# Altium schematic sheet USB2514 USB PORTS.SchDoc
size A4; DocumentNumber: 3; SheetNumber: 3; SheetTotal: 6
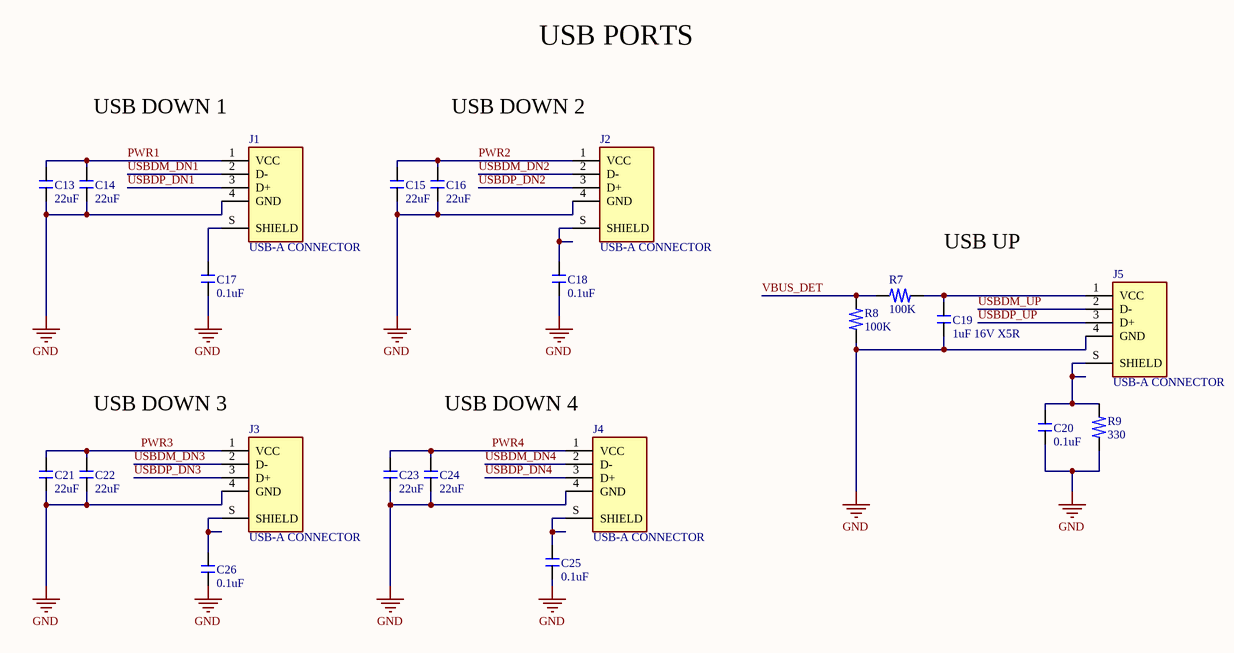
[diagram p0: USB2514 USB PORTS.SchDoc]

## Parts
C13  22uF  [CAPC3216X10N-1206]
C14  22uF  [CAPC3216X10N-1206]
C15  22uF  [CAPC3216X10N-1206]
C16  22uF  [CAPC3216X10N-1206]
C17  0.1uF  [CAPC1608X06N-0603]
C18  0.1uF  [CAPC1608X06N-0603]
C19  1uF 16V X5R  [CAPC1608X06N-0603]
C20  0.1uF  [CAPC1608X06N-0603]
C21  22uF  [CAPC3216X10N-1206]
C22  22uF  [CAPC3216X10N-1206]
C23  22uF  [CAPC3216X10N-1206]
C24  22uF  [CAPC3216X10N-1206]
C25  0.1uF  [CAPC1608X06N-0603]
C26  0.1uF  [CAPC1608X06N-0603]
J1  USB-A CONNECTOR  [USB-U-A-24DS-Y-1]
J2  USB-A CONNECTOR  [USB-U-A-24DS-Y-1]
J3  USB-A CONNECTOR  [USB-U-A-24DS-Y-1]
J4  USB-A CONNECTOR  [USB-U-A-24DS-Y-1]
J5  USB-A CONNECTOR  [USB-U-A-24DS-Y-1]
R7  100K  [RESC1608X06N-0603]
R8  100K  [RESC1608X06N-0603]
R9  330  [RESC1608X06N-0603]

## Nets
GND: C13.1 C14.1 C15.1 C16.1 C17.1 C18.1 C19.1 C20.1 C21.1 C22.1 C23.1 C24.1 C25.1 C26.1 J1.4(GND) J2.4(GND) J3.4(GND) J4.4(GND) J5.4(GND) R8.1 R9.1
PWR1: C13.2 C14.2 J1.1(VCC)
PWR2: C15.2 C16.2 J2.1(VCC)
PWR3: C21.2 C22.2 J3.1(VCC)
PWR4: C23.2 C24.2 J4.1(VCC)
USBDM_DN1: J1.2(D-)
USBDM_DN2: J2.2(D-)
USBDM_DN3: J3.2(D-)
USBDM_DN4: J4.2(D-)
USBDM_UP: J5.2(D-)
USBDP_DN1: J1.3(D+)
USBDP_DN2: J2.3(D+)
USBDP_DN3: J3.3(D+)
USBDP_DN4: J4.3(D+)
USBDP_UP: J5.3(D+)
VBUS_DET: R7.1 R8.2
NetC17_2: C17.2 J1.S(SHIELD)
NetC18_2: C18.2 J2.S(SHIELD)
NetC19_2: C19.2 J5.1(VCC) R7.2
NetC20_2: C20.2 J5.S(SHIELD) R9.2
NetC25_2: C25.2 J4.S(SHIELD)
NetC26_2: C26.2 J3.S(SHIELD)

## Notes on the sheet
- USB PORTS
- USB DOWN 1
- USB DOWN 2
- USB UP
- USB DOWN 3
- USB DOWN 4

## Library data of the parts
C13-C16 C21-C24 = CAP_1206_22uF
C17-C20 C25 C26 = CAP_0603_0.1uF
J1-J5 = USB-U-A-24DS-Y-1: USB-A (USB TYPE-A) USB 2.0; MF: Samtec; MP: USB-A-S-X-X-VU; Price: None; Availability: Unavailable; Value: *; Package: None
R7-R9 = RES_0603_1K